# EAGLE design RobotBooster_v1 (EAGLE 6.1)
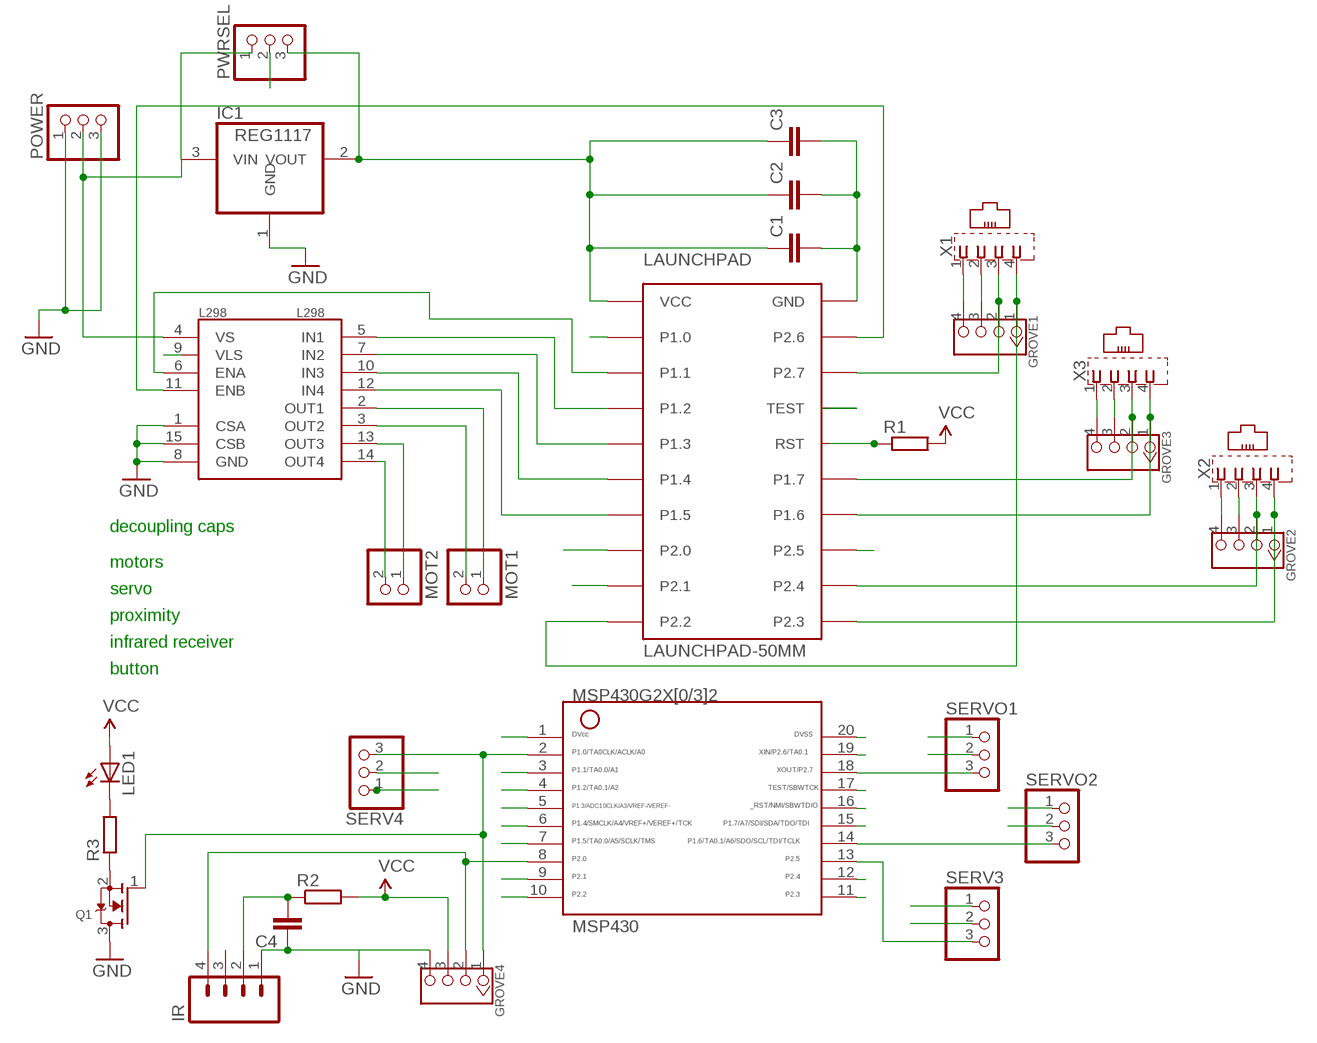
[diagram p0: schematic, sheet 1]

## Parts
C1  C-EU025-030X050  [C025-030X050]
C2  C-EU025-030X050  [C025-030X050]
C3  C-EUC1206  [C1206]
C4  C-EUC1206  [C1206]
GROVE1  TWIG-4P-2.0-2.0  [4P-2.0]
GROVE2  TWIG-4P-2.0-2.0  [4P-2.0]
GROVE3  TWIG-4P-2.0-2.0  [4P-2.0]
GROVE4  TWIG-4P-2.0-2.0  [4P-2.0]
IC1  REG1117  [SOT223]
IR  M04PTH  [1X04]
L298  L298  [MULTIWATT15]
LAUNCHPAD  LAUNCHPAD-50MM  [LAUNCHPAD-50MM]
LED1  LED5MM  [LED5MM]
MOT1  PINHD-1X2  [1X02]
MOT2  PINHD-1X2  [1X02]
MSP430  MSP430  G2X[0/3]2---N20  [N20]
POWER  PINHD-1X3  [1X03]
PWRSEL  PINHD-1X3  [1X03]
Q1  MOSFET-NREFLOW  [SOT23]
R1  R-EU_0207/10  [0207/10]
R2  R-EU_R1206  [R1206]
R3  R-EU_R1206  [R1206]
SERV3  PINHD-1X3  [1X03]
SERV4  PINHD-1X3  [1X03]
SERVO1  PINHD-1X3  [1X03]
SERVO2  PINHD-1X3  [1X03]
X1  XRJK-S-01-6-4-0-9M2  [XRJK-S-01-6-4-0-9M2]
X2  XRJK-S-01-6-4-0-9M2  [XRJK-S-01-6-4-0-9M2]
X3  XRJK-S-01-6-4-0-9M2  [XRJK-S-01-6-4-0-9M2]

## Nets
GND: C1.2 C2.2 C3.2 C4.1 GROVE1.4 GROVE2.4 GROVE3.4 GROVE4.4 IC1.1(GND) IR.1 L298.1(CSA) L298.8(GND) L298.15(CSB) LAUNCHPAD.GND MSP430.20 POWER.1 POWER.3 Q1.3(D) SERV3.1 SERV4.1 SERVO1.1 X1.1 X2.1 X3.1
N$1: L298.14(OUT4) MOT2.2
N$2: L298.13(OUT3) MOT2.1
N$3: L298.3(OUT2) MOT1.2
N$4: L298.2(OUT1) MOT1.1
N$5: C4.2 IR.2 R2.1
N$6: Q1.2(S) R3.1
N$7: LED1.K(C) R3.2
N$8: SERVO2.1
P1.0: GROVE4.1 LAUNCHPAD.P1.0 MSP430.2 Q1.1(G) SERV4.3
P1.1: L298.6(ENA) LAUNCHPAD.P1.1 MSP430.3
P1.2: L298.5(IN1) LAUNCHPAD.P1.2 MSP430.4
P1.3: L298.7(IN2) LAUNCHPAD.P1.3 MSP430.5
P1.4: L298.10(IN3) LAUNCHPAD.P1.4 MSP430.6
P1.5: L298.12(IN4) LAUNCHPAD.P1.5 MSP430.7
P1.6: GROVE3.1 LAUNCHPAD.P1.6 MSP430.14 SERVO2.3 X3.4
P1.7: GROVE3.2 LAUNCHPAD.P1.7 MSP430.15 X3.3
P2.0: GROVE4.2 IR.4 LAUNCHPAD.P2.0 MSP430.8
P2.1: LAUNCHPAD.P2.1 MSP430.9
P2.2: GROVE1.1 LAUNCHPAD.P2.2 MSP430.10 X1.4
P2.3: GROVE2.1 LAUNCHPAD.P2.3 MSP430.11 X2.4
P2.4: GROVE2.2 LAUNCHPAD.P2.4 MSP430.12 X2.3
P2.5: LAUNCHPAD.P2.5 MSP430.13 SERV3.3
P2.6: L298.11(ENB) LAUNCHPAD.P2.6 MSP430.19
P2.7: GROVE1.2 LAUNCHPAD.P2.7 MSP430.18 SERVO1.3 X1.3
RST: LAUNCHPAD.RST MSP430.16 R1.1
TEST: LAUNCHPAD.TEST MSP430.17
VBAT: IC1.3(VIN) L298.4(VS) POWER.2 PWRSEL.1
VCC: C1.1 C2.1 C3.1 GROVE1.3 GROVE2.3 GROVE3.3 GROVE4.3 IC1.2(VOUT) L298.9(VLS) LAUNCHPAD.VCC LED1.A MSP430.1 PWRSEL.3 R1.2 R2.2 X1.2 X2.2 X3.2
VSERV: PWRSEL.2 SERV3.2 SERV4.2 SERVO1.2 SERVO2.2
Unconnected: IR.3

## Notes on the sheet
- decoupling caps
- motors
- servo
- proximity
- infrared receiver
- button

## Library data of the parts
C1-C4 = resistor:C-EU: CAPACITOR, European symbol
GROVE1-GROVE4 = Connector:TWIG-4P-2.0
IC1 = burr-brown:REG1117: 800mA and 1A Low Dropout (LDO) Positive Regulator 1.8V, 2.5V, 2.85V, 3.3V, 5V, and Adj; MPN: REG1117; OC_FARNELL: 1097566; OC_NEWARK: 14P6981
IR = SparkFun-Connectors:M04: Header 4 Standard 4-pin 0.1" header. Use with straight break away headers (SKU : PRT-00116), right angle break away headers (PRT-00553), swiss pins (PRT-00743), machine pins (PRT-00117), and female headers (PRT-00115). Molex polarized connector foot print use with SKU : PRT-08231 with associated crimp pins and housings. 1MM SMD Version SKU: PRT-10208
L298 = SparkFun-PowerIC:L298: L298 Dual Full Bridge Driver
LAUNCHPAD = TI_launchpad:LAUNCHPAD: MSP-EXP430G2 LaunchPad Booster Pack layouts. LAUNCHPAD: Full-size board LAUNCHPAD-50MM: 50x50mm board covering the button area LAUNCHPAD-50MM-LEFT: 50x50mm board leaving the button area open. Tall LaunchPad components marked on Reference for reference.
LED1 = adafruit:LED: LED OSRAM: - CHIPLED LG R971, LG N971, LY N971, LG Q971, LY Q971, LO R971, LY R971 LH N974, LH R974 LS Q976, LO Q976, LY Q976 LO Q996 - Hyper CHIPLED LW Q18S LB Q993, LB Q99A, LB R99A - SideLED LS A670, LO A670, LY A670, LG A670, LP A670 LB A673, LV A673, LT A673, LW A673 LH A674 LY A675 LS A676, LA A676, LO A676, LY A676, LW A676 LS A679, LY A679, LG A679 - Hyper Micro SIDELED® LS Y876, LA Y876, LO Y876, LY Y876 LT Y87S - SmartLED LW L88C, LW L88S LB L89C, LB L89S, LG L890 LS L89K, LO L89K, LY L89K LS L896, LA L896, LO L896, LY L896 - TOPLED LS T670, LO T670, LY T670, LG T670, LP T670 LSG T670, LSP T670, LSY T670, LOP T670, LYG T670 LG T671, LOG T671, LSG T671 LB T673, LV T673, LT T673, LW T673 LH T674 LS T676, LA T676, LO T676, LY T676, LB T676, LH T676, LSB T676, LW T676 LB T67C, LV T67C, LT T67C, LS T67K, LO T67K, LY T67K, LW E67C LS E67B, LA E67B, LO E67B, LY E67B, LB E67C, LV E67C, LT E67C LW T67C LS T679, LY T679, LG T679 LS T770, LO T770, LY T770, LG T770, LP T770 LB T773, LV T773, LT T773, LW T773 LH T774 LS E675, LA E675, LY E675, LS T675 LS T776, LA T776, LO T776, LY T776, LB T776 LHGB T686 LT T68C, LB T68C - Hyper Mini TOPLED® LB M676 - Mini TOPLED Santana® LG M470 LS M47K, LO M47K, LY M47K Source: http://www.osram.convergy.de/
MOT1 MOT2 = pinhead:PINHD-1X2: PIN HEADER
MSP430 = TI_MSP430_v16:G2X[0/3]2---N20: MSP430G2X[0/3]2 MSP430G2x32, MSP430G2x02 PDIP (N) 20 Pin Package http://focus.ti.com/docs/prod/folders/print/msp430g2432.html
POWER PWRSEL SERV3 SERV4 SERVO1 SERVO2 = adafruit:PINHD-1X3: PIN HEADER
Q1 = adafruit:MOSFET-N: N-Channel Mosfet 2N7002E - 60V 260mA SOT23 [Digikey: 2N7002ET1GOSTR-ND] - REEL BSH103 - 30V 850mA SOT23 [Digikey: 568-5013-1-ND]
R1-R3 = resistor:R-EU_: RESISTOR, European symbol
X1-X3 = apus-spidisplay:XRJK*4: RJ11 Connector without LED, 6 position, 4 contacts, thrue hole Source: XRJK-S-01-6-4-0-9M2(01).pdf

## Board
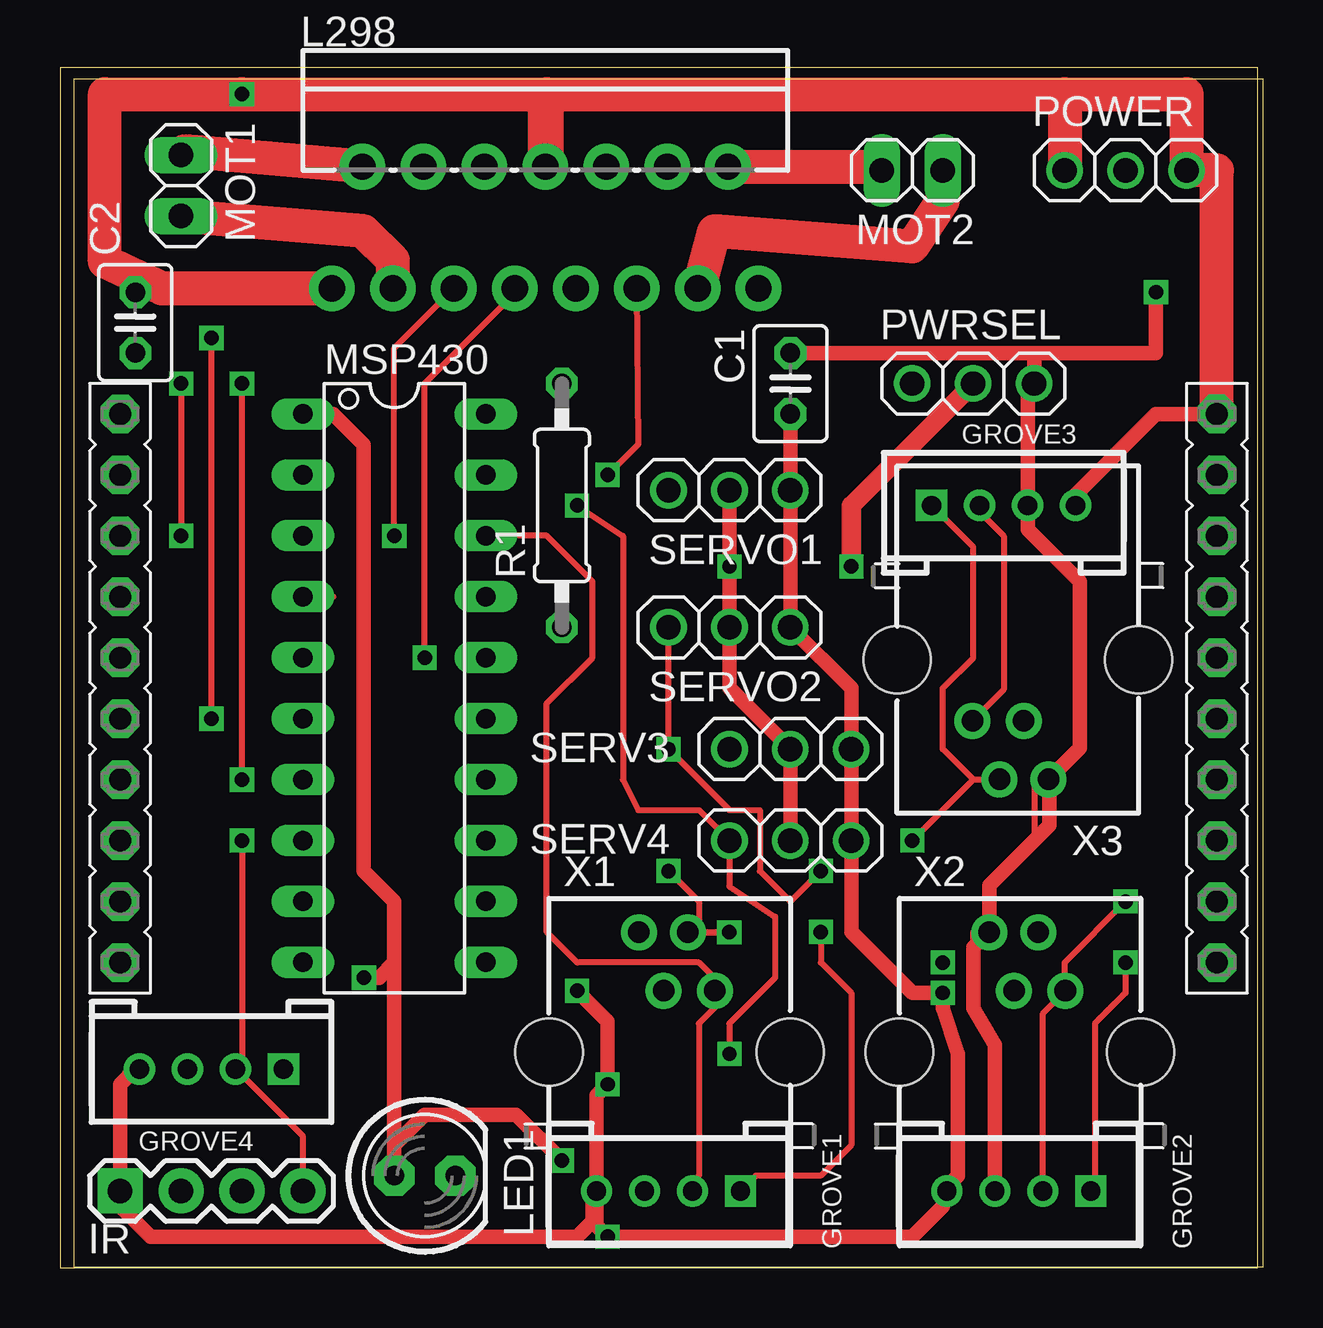
[diagram p1: board, top side]
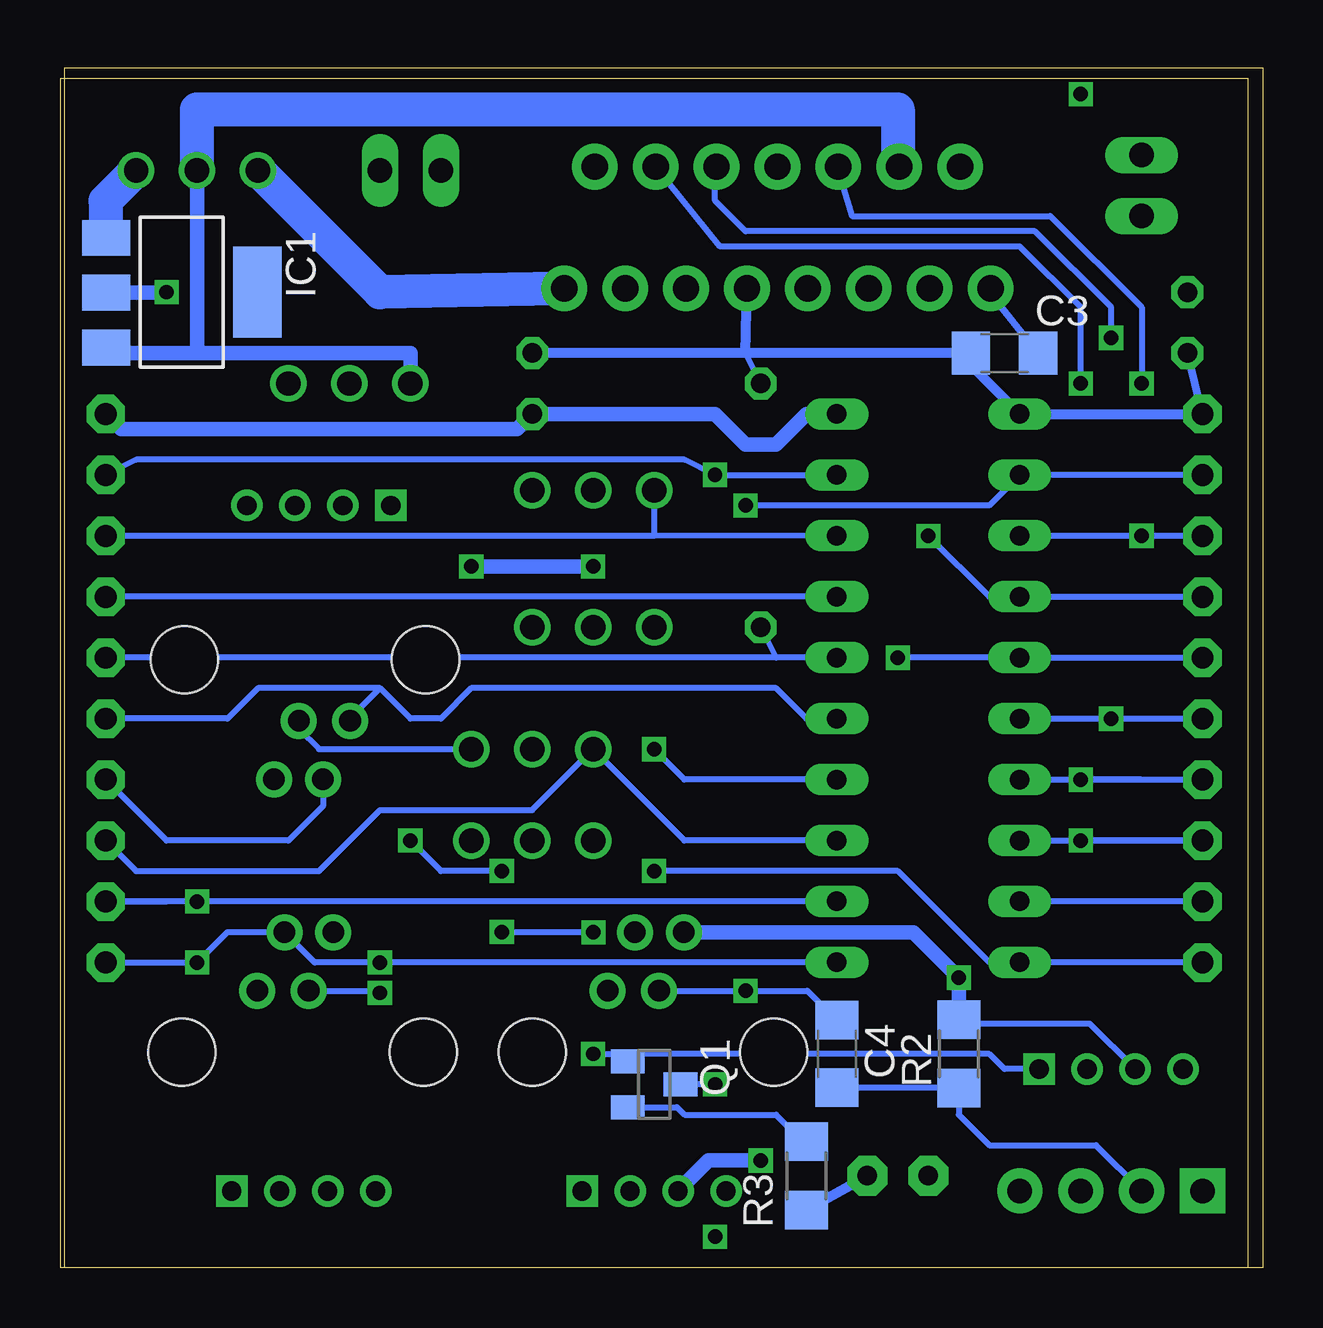
[diagram p2: board, bottom side, seen from below]

Size 49.94 x 50.02 mm. Coordinates in mm from the lower left corner, seen from the top.
Outline: 0,0 49.94,0 49.94,50.02 0,50.02 0,0
Copper layers (1*16): Top 0.035mm / dielectric 1.5mm / Bottom 0.035mm
Design rules: minimum track width 10mil, minimum drill 24mil, track to track 8mil, track to pad 8mil, pad to pad 8mil, via to via 8mil, smd to smd 8mil, copper to edge 40mil, drill to drill 8mil, minimum pad ring 10mil, minimum via ring 8mil, stop-mask expansion 4mil, vias tented up to drill 0mil, thermal gap 10mil

### Footprints (pad centres in the part's own frame; a part is rotated, then mirrored left to right if it is on the bottom)
C025-030X050 = drill 0.813 octagon: 1 -1.27,0; 2 1.27,0
C1206 = smd 1.6 x 1.8: 1 -1.4,0; 2 1.4,0
4P-2.0 = drill 0.8 pad 1.27 square: 1 -3,0 | drill 0.8 pad 1.27: 2 -1,0; 3 1,0; 4 3,0
SOT223 = smd 1.499 x 2.007: 1 -2.261,-3.15; 2 0.025,-3.15; 3 2.311,-3.15 | smd 3.81 x 2.007: 4 0,3.15
1X04 = drill 1.016 pad 1.88 square: 1 0,0 | drill 1.016 pad 1.88: 2 2.54,0; 3 5.08,0; 4 7.62,0
MULTIWATT15 = drill 1.1 pad 1.9: 1 -8.95,-2.39; 2 -7.68,2.69; 3 -6.41,-2.39; 4 -5.14,2.69; 5 -3.87,-2.39; 6 -2.6,2.69; 7 -1.33,-2.39; 8 -0.06,2.69; 9 1.21,-2.39; 10 2.48,2.69; 11 3.75,-2.39; 12 5.02,2.69; 13 6.29,-2.39; 14 7.56,2.69; 15 8.83,-2.39
LAUNCHPAD-50MM = drill 0.914 pad 1.6 octagon: GND 13.97,48.26; P1.0 16.51,2.54; P1.1 19.05,2.54; P1.2 21.59,2.54; P1.3 24.13,2.54; P1.4 26.67,2.54; P1.5 29.21,2.54; P1.6 29.21,48.26; P1.7 26.67,48.26; P2.0 31.75,2.54; P2.1 34.29,2.54; P2.2 36.83,2.54; P2.3 36.83,48.26; P2.4 34.29,48.26; P2.5 31.75,48.26; P2.6 16.51,48.26; P2.7 19.05,48.26; RST 24.13,48.26; TEST 21.59,48.26; VCC 13.97,2.54
LED5MM = drill 0.813 pad 1.676 octagon: A -1.27,0; K 1.27,0
1X02 = drill 1.016 long: 1 -1.27,0; 2 1.27,0
N20 = drill 0.813 long: 1 -11.435,-3.81; 2 -8.895,-3.81; 3 -6.355,-3.81; 4 -3.815,-3.81; 5 -1.275,-3.81; 6 1.265,-3.81; 7 3.805,-3.81; 8 6.345,-3.81; 9 8.885,-3.81; 10 11.425,-3.81; 11 11.425,3.81; 12 8.885,3.81; 13 6.345,3.81; 14 3.805,3.81; 15 1.265,3.81; 16 -1.275,3.81; 17 -3.815,3.81; 18 -6.355,3.81; 19 -8.895,3.81; 20 -11.435,3.81
1X03 = drill 1.016: 1 -2.54,0; 2 0,0; 3 2.54,0
SOT23 = smd 1 x 1.4: 1 -0.95,-1.1; 2 0.95,-1.1; 3 0,1.1
0207/10 = drill 0.813 octagon: 1 -5.08,0; 2 5.08,0
R1206 = smd 1.6 x 1.803: 1 -1.422,0; 2 1.422,0
XRJK-S-01-6-4-0-9M2 = drill 0.9 pad 1.5: 1 -0.205,-2.45; 2 -1.235,-0.01; 3 1.935,-2.45; 4 0.805,-0.01 | hole 2.8: -4.98,-5; 5.08,-5

### Placement (x,y rotation side)
C1  30.45,36.86 270 top
C2  3.14,39.4 90 top
C3  10.76,38.13 0 bottom
C4  17.75,8.92 270 bottom
GROVE1  25.36,3.2 180 top
GROVE2  39.97,3.2 180 top
GROVE3  39.34,31.78 0 top
GROVE4  6.31,8.29 180 top
IC1  45.05,40.67 270 bottom
IR  2.5,3.2 0 top
L298  20.29,43.21 0 top
LAUNCHPAD  -0.04,49.56 270 top
LED1  15.21,3.84 0 top
MOT1  5.04,45.12 270 top
MOT2  35.53,45.75 180 top
MSP430  13.94,24.16 270 top
POWER  44.42,45.75 0 top
PWRSEL  38.07,36.86 0 top
Q1  25.36,7.65 270 bottom
R1  20.92,31.78 90 top
R2  12.66,8.92 90 bottom
R3  19.02,3.84 270 bottom
SERV3  30.45,21.62 180 top
SERV4  30.45,17.81 180 top
SERVO1  27.91,32.41 180 top
SERVO2  27.91,26.7 180 top
X1  25.36,14 0 top
X2  39.97,14 0 top
X3  39.97,20.35 180 top

### Tracks (layer width: path | path; a pad name or v marks a point on that pad's centre or on a via)
GND  (via drill 0.6)
  Top 0.254: LAUNCHPAD.GND | LAUNCHPAD.GND 46.96,35.59 46.95,35.59 LAUNCHPAD.GND | LAUNCHPAD.GND | LAUNCHPAD.GND 46.15,35.59 | 36.97,11.29 v36.8,11.46 | v21.55,11.55 21.55,11.46
  Top 0.305: C2.2 2.5,41.94 1.87,41.94
  Top 0.61: C1.2 SERVO1.1 30.45,26.7 32.99,24.16 SERV3.1 SERV4.1 32.99,14 35.53,11.46 v36.8,11.46 36.8,10.82 37.43,8.92 37.43,3.84 36.97,3.38 | GROVE4.4 3.14,8.29 2.5,7.65 IR.1 2.5,2.57 3.77,1.3 21.55,1.3 22.19,1.94 22.19,3.2 GROVE1.4 | 36.97,3.38 36.8,3.2 | 36.97,3.38 GROVE2.4 36.8,3.03 36.8,2.57 35.53,1.3 v22.82,1.3 22.36,1.76 GROVE1.4 | GROVE1.4 22.36,7.19 v22.82,7.65 22.82,10.28 v21.55,11.55 | GROVE3.4 42.34,32.24 45.69,35.59 LAUNCHPAD.GND
  Top 1.422: L298.1 4.26,40.82 1.87,41.94 1.87,48.93 v7.58,48.93 20.29,48.93 | 20.29,48.93 20.29,45.75 | L298.8 20.23,48.23 20.29,48.93 | 20.29,48.93 41.88,48.93 | 41.88,48.93 POWER.1 | 41.88,48.93 46.96,48.93 POWER.3 48.23,45.75 LAUNCHPAD.GND
  Bottom 0.254: C4.1 18.98,11.55 v21.55,11.55 21.55,11.46 21.64,11.55 X1.1 25.27,11.55 | X3.1 40.18,22.46 39.34,21.62 SERV3.1 | X2.1 36.89,11.55 v36.8,11.46 | v22.82,7.65 Q1.3
  Bottom 0.305: C3.2 11.39,40.67 L298.1
  Bottom 0.61: MSP430.20 19.01,35.59 20.29,34.32 21.55,34.32 22.82,35.59 C1.2 31.07,34.96 47.59,34.96 LAUNCHPAD.GND
  Bottom 1.422: L298.15 29.32,40.82 36.8,40.67 POWER.1 | POWER.3 48.23,44.48 48.2,44.45 IC1.1
N$1
  Top 1.422: L298.14 34.11,45.9 MOT2.2
N$2
  Top 1.422: MOT2.1 36.8,44.48 35.53,42.58 27.27,43.21 26.64,40.88 L298.13
N$3
  Top 1.422: L298.3 13.88,42 12.66,43.21 MOT1.2
N$4
  Top 1.422: L298.2 5.2,46.54 MOT1.1
N$5
  Bottom 0.254: C4.2 17.72,7.5 R2.1 12.66,6.38 11.39,5.11 6.95,5.11 IR.2
N$6
  Bottom 0.254: Q1.2 24.41,6.7 24.09,6.38 20.29,6.38 19.02,5.11 R3.1
N$7
  Bottom 0.406: R3.2 LED1.K
P1.0  (via drill 0.6)
  Top 0.254: v21.55,31.78 23.46,30.51 23.46,20.35 24.09,19.08 26.64,19.08 SERV4.3 27.91,15.9 29.81,14.63 29.81,12.09 27.91,10.19 v27.91,8.92
  Bottom 0.254: LAUNCHPAD.P1.0 MSP430.2 | MSP430.2 | MSP430.2 11.39,31.78 v21.55,31.78 | v27.91,8.92 26.79,8.92 Q1.1 26.14,8.92 11.39,8.92 10.76,8.29 GROVE4.1
P1.1  (via drill 0.6)
  Top 0.254: v5.04,36.86 v5.04,30.52
  Bottom 0.254: MSP430.3 v5.04,30.52 LAUNCHPAD.P1.1 | L298.6 17.68,45.69 17.11,43.84 8.86,43.84 5.04,40.04 v5.04,36.86
P1.2  (via drill 0.6)
  Top 0.254: MSP430.4 11.4,27.98 | v13.94,30.51 13.94,38.34 L298.5
  Bottom 0.254: v13.94,30.51 11.4,27.98 MSP430.4 LAUNCHPAD.P1.2
P1.3  (via drill 0.6)
  Top 0.254: v15.21,25.43 15.21,36.86 19.02,40.67 18.95,40.73 L298.7
  Bottom 0.254: v15.21,25.43 v15.2,25.44 MSP430.5 LAUNCHPAD.P1.3
P1.4  (via drill 0.6)
  Top 0.254: v6.31,22.89 v6.31,38.77
  Bottom 0.254: 8.85,22.89 MSP430.6 | MSP430.6 LAUNCHPAD.P1.4 | MSP430.6 v6.32,22.89 v6.31,22.89 | L298.10 22.82,45.84 22.82,44.48 21.55,43.21 9.49,43.21 6.31,40.04 v6.31,38.77
P1.5  (via drill 0.6)
  Top 0.254: v7.58,20.35 v7.58,36.86
  Bottom 0.254: 8.85,20.35 MSP430.7 | MSP430.7 | MSP430.7 LAUNCHPAD.P1.5 | MSP430.7 5.05,20.36 v7.58,20.35 | L298.12 22.61,42.58 10.12,42.58 7.58,40.04 v7.58,36.86
P1.6  (via drill 0.6)
  Top 0.254: SERVO2.3 v25.36,21.62 27.91,19.08 29.18,19.08 29.18,16.54 30.45,15.27 v31.71,16.54 | v35.53,17.81 38.07,20.35 | 38.07,20.35 X3.4 | 38.07,20.35 36.8,21.62 36.8,24.16 38.07,25.43 38.07,30.05 GROVE3.1
  Bottom 0.254: X3.4 39.17,19.25 40.61,17.81 45.69,17.81 LAUNCHPAD.P1.6 | MSP430.14 24.1,20.36 v25.36,21.62 | v31.71,16.54 34.26,16.54 v35.53,17.81
P1.7
  Top 0.254: GROVE3.2 38.34,31.51 39.34,30.51 39.34,24.1 X3.3
  Bottom 0.254: MSP430.15 19.02,22.89 20.29,24.16 32.99,24.16 34.26,22.89 35.53,22.89 36.8,24.16 | 36.8,24.16 41.88,24.16 43.15,22.89 LAUNCHPAD.P1.7 | X3.3 38.04,22.92 36.8,24.16
P2.0  (via drill 0.6)
  Top 0.254: v7.58,17.81 7.58,8.55 GROVE4.2 10.12,5.48 IR.4
  Bottom 0.254: MSP430.8 LAUNCHPAD.P2.0 v7.58,17.81
P2.1
  Bottom 0.254: LAUNCHPAD.P2.1 MSP430.9
P2.2  (via drill 0.6)
  Top 0.254: v25.36,16.54 26.64,15.27 26.64,14 v27.89,13.99 X1.4 | v31.71,14 31.71,12.73 32.99,11.46 32.99,5.11 31.71,3.84 29,3.84 GROVE1.1
  Bottom 0.254: LAUNCHPAD.P2.2 MSP430.10 11.4,12.73 15.21,16.54 v25.36,16.54 | v27.89,13.99 v31.7,13.99 v31.71,14
P2.3  (via drill 0.6)
  Top 0.254: v44.42,12.73 44.42,11.46 43.15,10.19 43.15,3.38 GROVE2.1
  Bottom 0.254: LAUNCHPAD.P2.3 v44.42,12.73 43.15,14 X2.4 39.52,12.73 v36.8,12.73 34.25,12.73 MSP430.11
P2.4  (via drill 0.6)
  Top 0.254: v44.42,15.27 41.88,12.73 41.88,11.46 X2.3 | X2.3 41.88,11.55 | GROVE2.2 40.97,10.62 X2.3
  Bottom 0.254: LAUNCHPAD.P2.4 45.69,15.27 | MSP430.12 LAUNCHPAD.P2.4 | v44.42,15.27 LAUNCHPAD.P2.4
P2.5
  Bottom 0.254: LAUNCHPAD.P2.5 46.96,16.54 39.34,16.54 36.8,19.08 30.45,19.08 SERV3.3 24.1,17.82 MSP430.13
P2.6  (via drill 0.6)
  Top 0.254: v22.83,33.05 24.09,34.32 L298.11
  Bottom 0.254: LAUNCHPAD.P2.6 46.96,33.69 24.09,33.69 v22.83,33.05 MSP430.19
P2.7
  Top 0.254: GROVE1.2 26.36,3.57 26.64,3.84 26.64,10.19 27.3,10.85 X1.3 27.3,12.06 26.64,12.73 21.55,12.73 20.29,14 20.29,23.53 22.19,25.43 22.19,28.61 20.29,30.52 MSP430.18 | MSP430.18
  Bottom 0.254: MSP430.18 25.36,30.51 | 25.36,30.51 LAUNCHPAD.P2.7 | SERVO1.3 25.36,30.51 | 25.36,30.51
RST
  Bottom 0.254: MSP430.16 20.29,25.44 | 20.29,25.44 LAUNCHPAD.RST | R1.1 20.29,25.44
TEST
  Bottom 0.254: MSP430.17 LAUNCHPAD.TEST
VBAT
  Bottom 0.61: POWER.2 44.42,38.13 | 44.42,38.13 47.97,38.13 IC1.3 | 44.42,38.13 35.53,38.13 PWRSEL.1
  Bottom 1.422: POWER.2 44.42,48.29 15.21,48.29 15.21,45.96 L298.4
VCC  (via drill 0.6)
  Top 0.254: 38.07,12.73 38.07,14 X2.2 | 40.61,17.81 40.61,20.35 X3.2
  Top 0.61: v45.69,40.67 45.69,38.13 40.61,38.13 | 40.61,38.13 C1.1 | 40.61,38.13 PWRSEL.3 40.34,36.59 GROVE3.3 40.34,30.78 42.51,28.61 42.51,21.67 X3.2 | 13.94,12.73 LED1.A 13.94,5.11 15.21,6.38 19.02,6.38 v20.92,4.48 | 13.94,12.73 13.94,15.27 12.66,16.54 12.66,34.32 11.39,35.59 MSP430.1 | v12.66,12.09 13.3,12.09 13.94,12.73 | GROVE2.3 38.97,9.29 38.07,10.82 38.07,12.73 38.07,13.37 38.7,14 | X2.2 38.74,15.94 40.61,17.81 41.24,18.45 41.24,20.35
  Bottom 0.254: R1.2 21.55,38.13 | R2.2 12.66,10.19 7.22,10.19 GROVE4.3 | 12.66,38.13 C3.1 | LAUNCHPAD.VCC
  Bottom 0.305: LAUNCHPAD.VCC C2.1
  Bottom 0.406: LAUNCHPAD.VCC MSP430.1 12.66,38.13 21.55,38.13 | 21.55,38.13 C1.1 | 21.55,38.13 L298.9
  Bottom 0.61: 21.55,40.76 L298.9 | IC1.2 45.71,40.65 v45.69,40.67 | R2.2 v12.66,12.09 14.56,13.99 X1.2 | v20.92,4.48 23.09,4.48 GROVE1.3
VSERV  (via drill 0.6)
  Top 0.61: SERV4.2 SERV3.2 27.91,24.16 SERVO2.2 v27.91,29.24 SERVO1.2
  Top 0.813: v32.99,29.24 32.99,31.78 PWRSEL.2
  Bottom 0.61: v32.99,29.24 v27.91,29.24